# EAGLE design Main PDU (EAGLE 9.5.2)
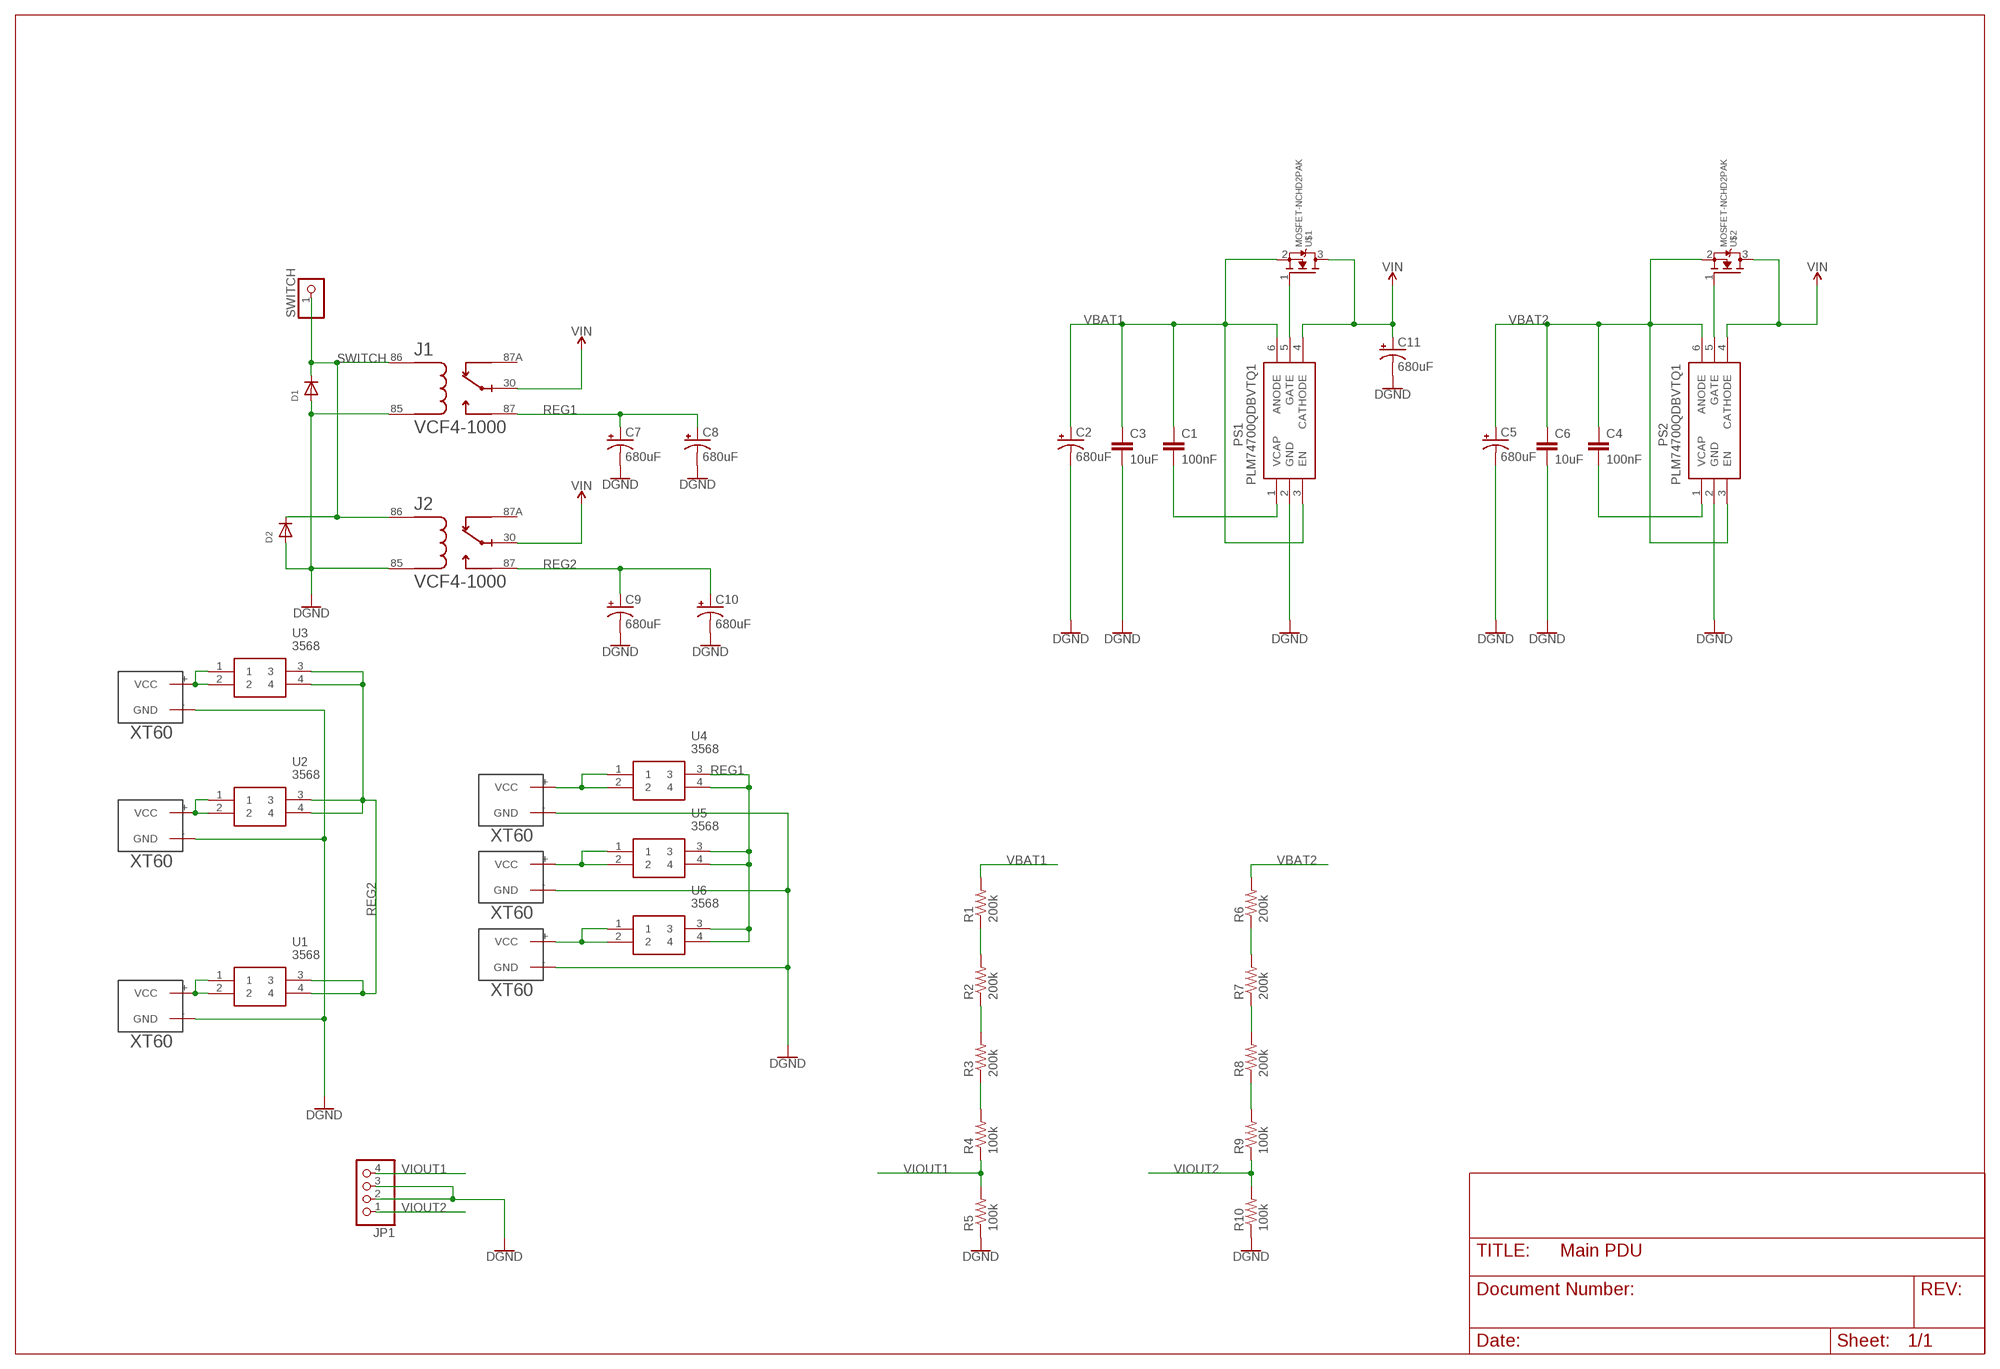
[diagram p0: schematic, sheet 1]

## Parts
C1  100nF  C-EUC0805  [C0805]
C2  680uF  CPOL-USE5-10.5  [E5-10,5]
C3  10uF  C-EUC1206  [C1206]
C4  100nF  C-EUC0805  [C0805]
C5  680uF  CPOL-USE5-10.5  [E5-10,5]
C6  10uF  C-EUC1206  [C1206]
C7  680uF  CPOL-USE5-10.5  [E5-10,5]
C8  680uF  CPOL-USE5-10.5  [E5-10,5]
C9  680uF  CPOL-USE5-10.5  [E5-10,5]
C10  680uF  CPOL-USE5-10.5  [E5-10,5]
C11  680uF  CPOL-USE5-10.5  [E5-10,5]
D1  DIODESOD-123  [SOD-123]
D2  DIODESOD-123  [SOD-123]
J1  VCF4-1000  [TE_VCF4-1000]
J2  VCF4-1000  [TE_VCF4-1000]
JP1  PINHD-1X4  [1X04]
PS1  PLM74700QDBVTQ1  [SOT95P280X145-6N]
PS2  PLM74700QDBVTQ1  [SOT95P280X145-6N]
R1  200k  R-US_R0805  [R0805]
R2  200k  R-US_R0805  [R0805]
R3  200k  R-US_R0805  [R0805]
R4  100k  R-US_R0805  [R0805]
R5  100k  R-US_R0805  [R0805]
R6  200k  R-US_R0805  [R0805]
R7  200k  R-US_R0805  [R0805]
R8  200k  R-US_R0805  [R0805]
R9  100k  R-US_R0805  [R0805]
R10  100k  R-US_R0805  [R0805]
SWITCH  PINHD-1X1  [1X01]
U1  3568  [3568]
U2  3568  [3568]
U3  3568  [3568]
U4  3568  [3568]
U5  3568  [3568]
U6  3568  [3568]
U$1  MOSFET-NCHD2PAK  [MBRB41H100CTT4G]
U$2  MOSFET-NCHD2PAK  [MBRB41H100CTT4G]
U$3  XT60  [XT60]
U$4  XT60  [XT60]
U$6  XT60  [XT60]
U$7  XT60  [XT60]
U$8  XT60  [XT60]
U$10  XT60  [XT60]

## Nets
GND: C2.- C3.2 C5.- C6.2 C7.- C8.- C9.- C10.- C11.- D1.A D2.A J1.85 J2.85 JP1.2 JP1.3 PS1.2(GND) PS2.2(GND) R5.1 R10.1 U$3.-(GND) U$4.-(GND) U$6.-(GND) U$7.-(GND) U$8.-(GND) U$10.-(GND) ; supply symbol labelled DGND
N$1: PS1.5(GATE) U$1.1(G)
N$2: C1.2 PS1.1(VCAP)
N$3: R1.1 R2.2
N$4: R2.1 R3.2
N$5: C4.2 PS2.1(VCAP)
N$6: PS2.5(GATE) U$2.1(G)
N$7: R3.1 R4.2
N$8: R6.1 R7.2
N$9: R7.1 R8.2
N$10: R8.1 R9.2
N$11: U1.1 U1.2 U$8.+(VCC)
N$12: U6.1 U6.2 U$4.+(VCC)
N$13: U3.1 U3.2 U$10.+(VCC)
N$15: U2.1 U2.2 U$7.+(VCC)
N$16: U5.1 U5.2 U$3.+(VCC)
N$18: U4.1 U4.2 U$6.+(VCC)
REG1: C7.+ C8.+ J1.87 U4.3 U4.4 U5.3 U5.4 U6.3 U6.4
REG2: C9.+ C10.+ J2.87 U1.3 U1.4 U2.3 U2.4 U3.3 U3.4
SWITCH: D1.C D2.C J1.86 J2.86 SWITCH.1
VBAT1: C1.1 C2.+ C3.1 PS1.3(EN) PS1.6(ANODE) R1.2 U$1.2(S)
VBAT2: C4.1 C5.+ C6.1 PS2.3(EN) PS2.6(ANODE) R6.2 U$2.2(S)
VIN: C11.+ J1.30 J2.30 PS1.4(CATHODE) PS2.4(CATHODE) U$1.3(D) U$2.3(D)
VIOUT1: JP1.4 R4.1 R5.2
VIOUT2: JP1.1 R9.1 R10.2
Unconnected: J1.87A J2.87A

## Library data of the parts
C1 C3 C4 C6 = rcl:C-EU: CAPACITOR, European symbol; SPICEPREFIX: C
C2 C5 C7-C11 = rcl:CPOL-US: POLARIZED CAPACITOR, American symbol; SPICEPREFIX: C
D1 D2 = adafruit:DIODE: Diode SMADIODE - SMA Surface Mount Package 20V 1A Schottky Diode Digikey: 641-1014-6-ND DO-1N4148 - Through Hole Small Current Diode SOD-123 20V 1 A (.5mV Vf) Schottky Diode - Digikey: MBRX120TPMSCT-ND SOD-323 10V 570mA (.38mV Vf, 3ns) Schottky Diode - Digikey: ZLLS410CT-ND SOD-523 30V 30mA Schottky Diode (RB751S-40TE61) - Digikey: RB751S-40TE61CT-ND SOT23-R/W - SOT23 Package (R = Solder Paste/Reflow Ovens, W = Hand-Soldering) BAT54Film 40V 300mA - Digikey: 497-7162-1-ND
J1 J2 = SPEAR:VCF4-1000: Socket, Relay; PCB, VTF Series, 1 Pole, Quick-Connect, w/o Grounding Provision; AVAILABILITY: Unavailable; COMMENT: 1393310-3; DESCRIPTION: Socket, Relay; PCB, VTF Series, 1 Pole, Quick-Connect, w/o Grounding Provision; MF: TE Connectivity; MP: VCF4-1000; PACKAGE: None; PRICE: None; PRODUCT_TYPE: Socket; TE_PURCHASE_URL: https://www.te.com/usa-en/product-1393310-3.html?te_bu=Cor&te_type=disp&te_campaign=seda_glo_cor-seda-global-disp-prtnr-fy19-seda-model-bom-cta_sma-317_1&elqCampaignId=32493
JP1 = pinhead:PINHD-1X4: PIN HEADER
PS1 PS2 = SPEAR:PLM74700QDBVTQ1: Low Iq, Always On Smart Diode Controller Source: Datasheet <http://www.ti.com/lit/gpn/lm74700-q1>; DESCRIPTION: Low Iq, Always On Smart Diode Controller; HEIGHT: 1.45mm; MANUFACTURER_NAME: Texas Instruments; MANUFACTURER_PART_NUMBER: PLM74700QDBVTQ1; MOUSER_PART_NUMBER: 595-PLM74700QDBVTQ1; MOUSER_PRICE-STOCK: https://www.mouser.com/Search/Refine.aspx?Keyword=595-PLM74700QDBVTQ1
R1-R10 = rcl:R-US_: RESISTOR, American symbol; SPICEPREFIX: R
SWITCH = pinhead:PINHD-1X1: PIN HEADER
U1-U6 = LCSC:3568: Fuse Holder .63 MINI FUSE HOLDER Source: Datasheet <http://www.keyelco.com/product-pdf.cfm?p=306>; ALLIED_NUMBER: 70182434; ALLIED_PRICE-STOCK: http://www.alliedelec.com/keystone-electronics-3568/70182434/; DESCRIPTION: Fuse Holder .63 MINI FUSE HOLDER; HEIGHT: 7.37mm; MANUFACTURER_NAME: Keystone Electronics; MANUFACTURER_PART_NUMBER: 3568; MOUSER_PART_NUMBER: 534-3568; MOUSER_PRICE-STOCK: https://www.mouser.com/Search/Refine.aspx?Keyword=534-3568
U$1 U$2 = SPEAR:MOSFET-NCH: N-Channel MOSFET like the IPB80N03S4L-03.
U$3 U$4 U$6-U$8 U$10 = LCSC:XT60: XT60

## Board
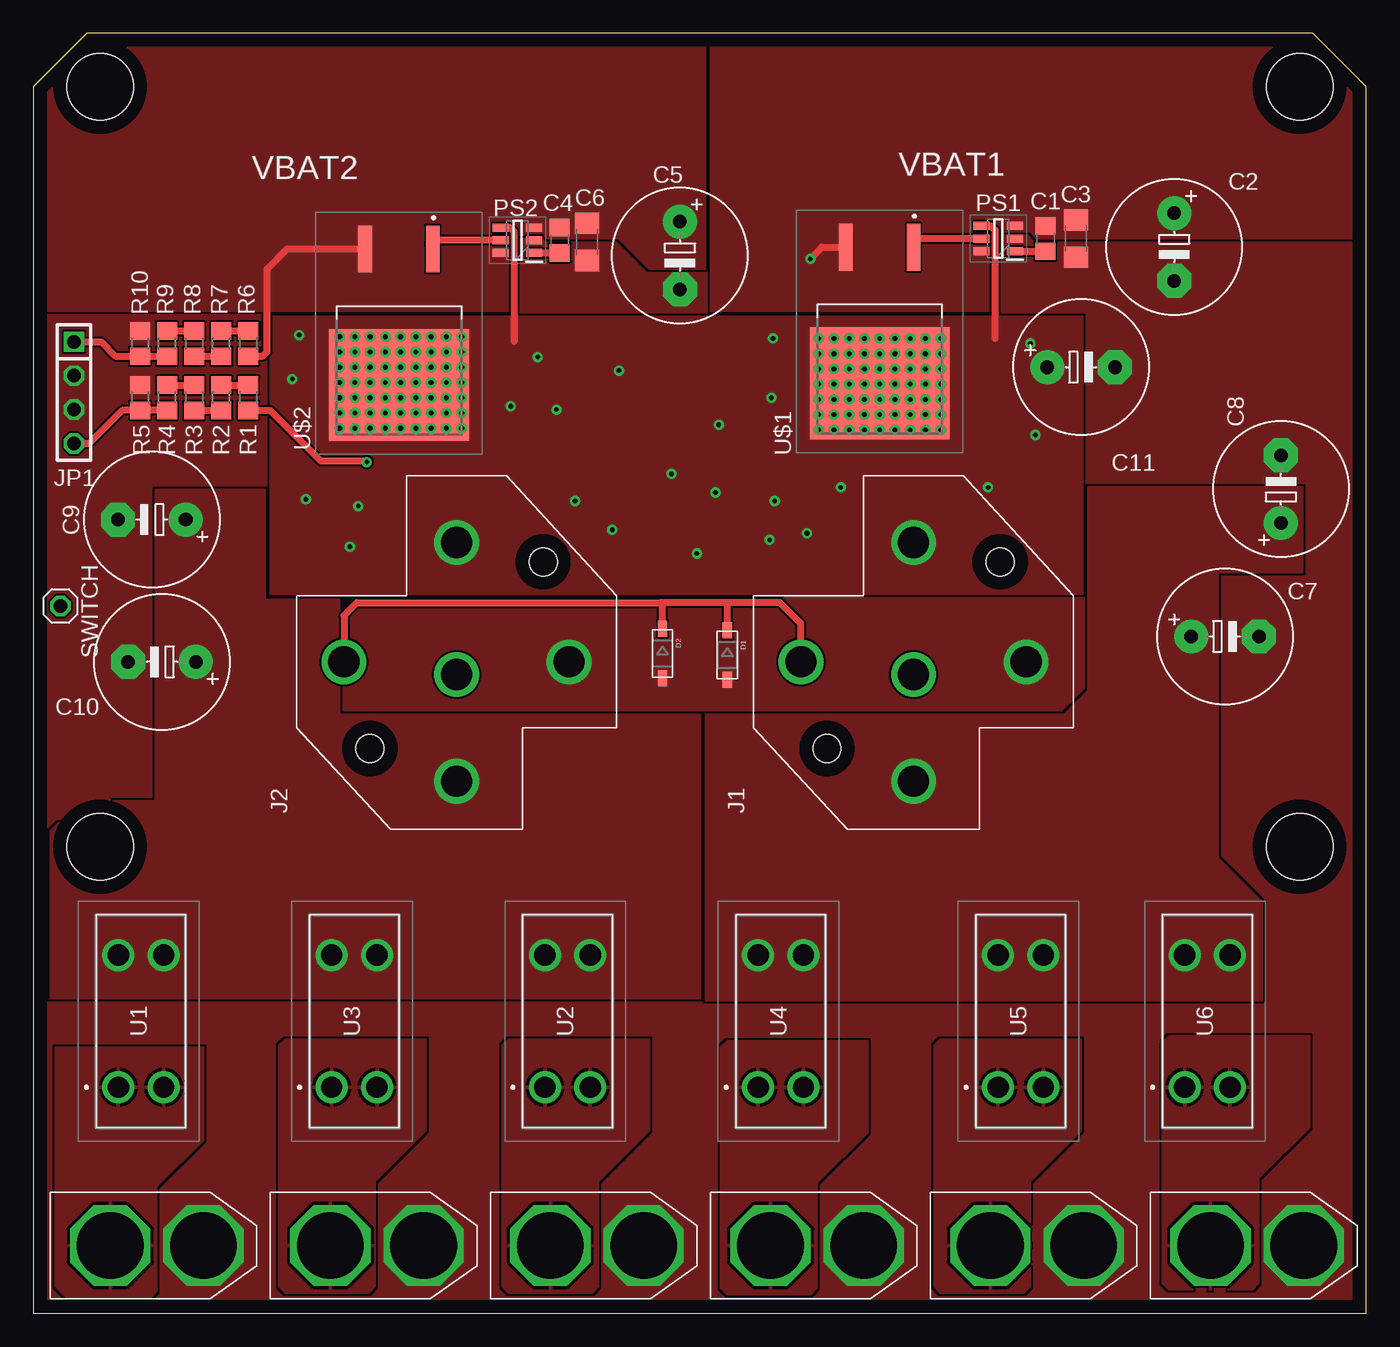
[diagram p1: board, top side]
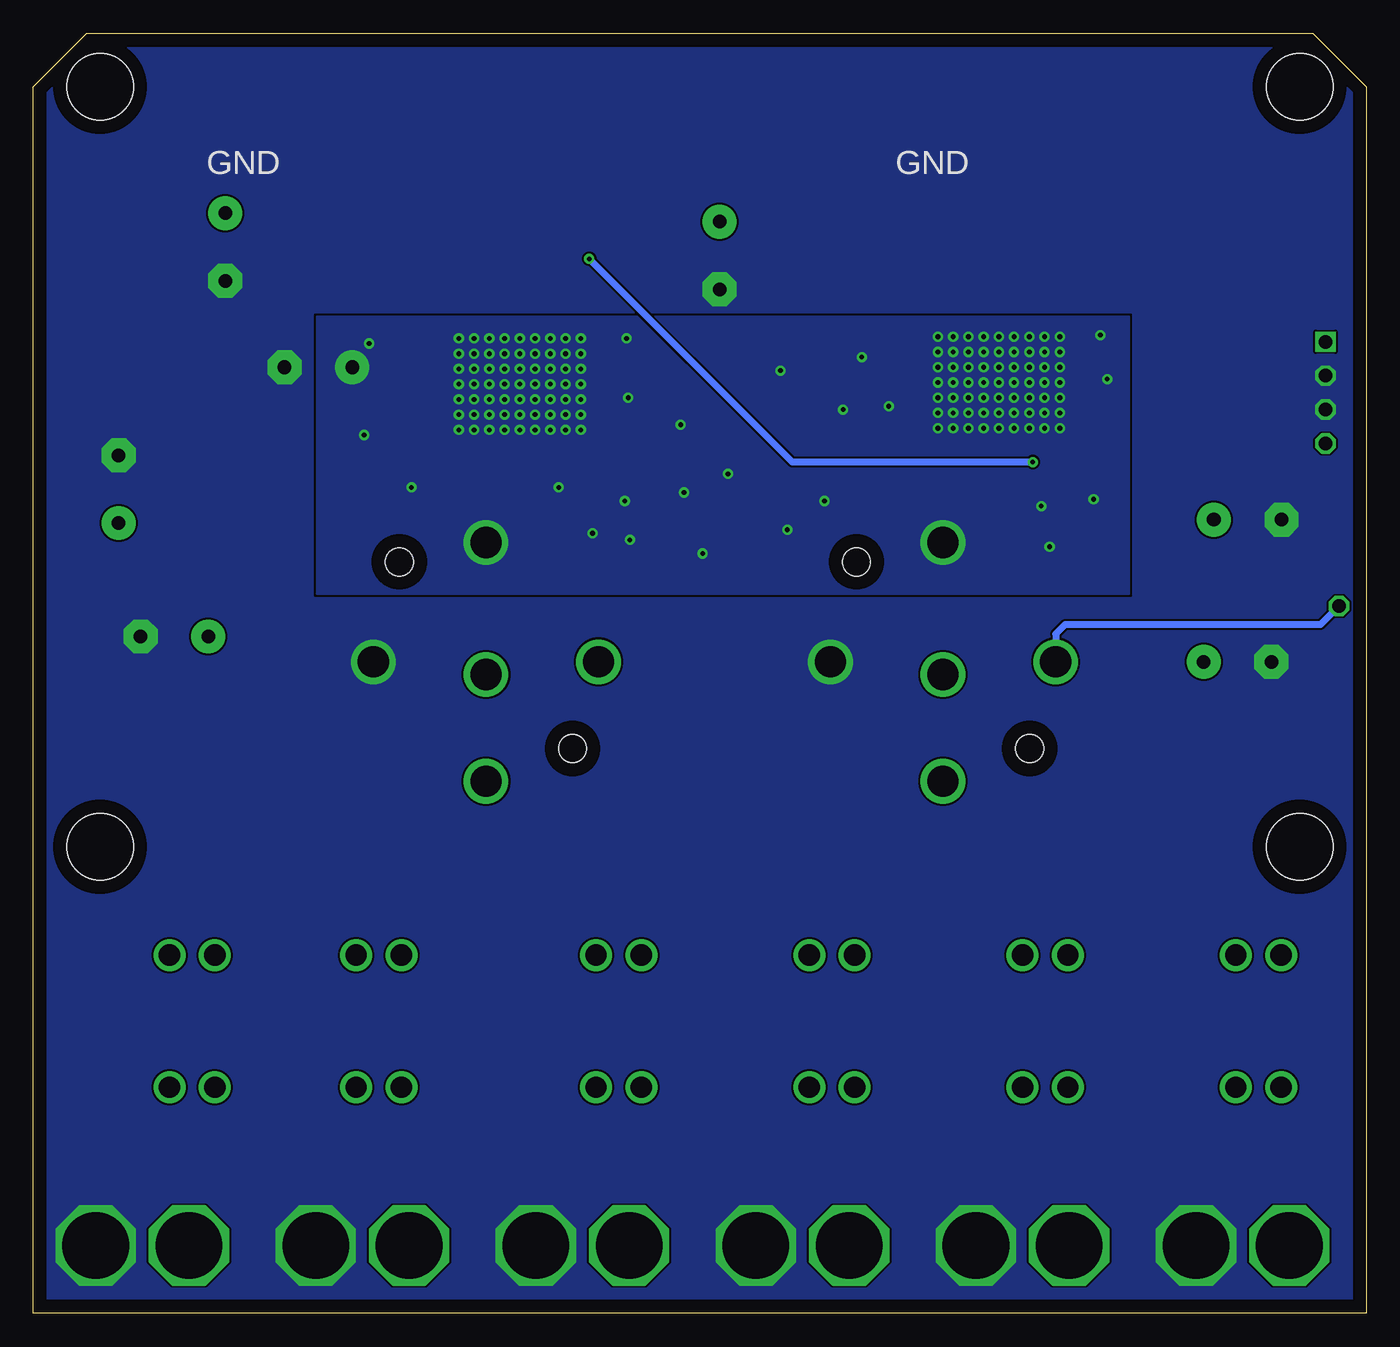
[diagram p2: board, bottom side, seen from below]

Size 100 x 96 mm. Coordinates in mm from the lower left corner, seen from the top.
Outline: 0,92 0,0 100,0 100,92 96,96 4,96 0,92
Copper layers (1*16): Top 0.035mm / dielectric 1.5mm / Bottom 0.035mm
Design rules "default *": minimum track width 6mil, minimum drill 0.35mm, track to track 6mil, track to pad 6mil, pad to pad 6mil, via to via 6mil, smd to smd 6mil, copper to edge 40mil, drill to drill 6mil, minimum pad ring 10mil, minimum via ring 8mil, stop-mask expansion 4mil, vias tented up to drill 20mil, thermal gap 10mil
Holes 5 mm at 5,92 95,92 95,35 5,35

### Footprints (pad centres in the part's own frame; a part is rotated, then mirrored left to right if it is on the bottom)
C0805 = smd 1.3 x 1.5: 1 -0.95,0; 2 0.95,0
E5-10,5 = drill 1.016 pad 2.54: + -2.54,0 | drill 1.016 pad 2.54 octagon: - 2.54,0
C1206 = smd 1.6 x 1.8: 1 -1.4,0; 2 1.4,0
SOD-123 = smd 1.2 x 0.7: A 1.85,0; C -1.85,0
TE_VCF4-1000 = drill 2.337: 30 8.95,0; 85 0,-8.45; 86 0,8.45; 87 -8.95,0; 87A -0.95,0 | hole 2.1: 7.5,-6.5; -6.5,6.5
1X04 = drill 1.016 square: 1 -3.81,0 | drill 1.016 octagon: 2 -1.27,0; 3 1.27,0; 4 3.81,0
SOT95P280X145-6N = smd 1.2 x 0.6: 1 -1.25,0.95; 2 -1.25,0; 3 -1.25,-0.95; 4 1.25,-0.95; 5 1.25,0; 6 1.25,0.95
R0805 = smd 1.3 x 1.5: 1 -0.95,0; 2 0.95,0
1X01 = drill 1.016 octagon: 1 0,0
3568 = drill 1.6 pad 2.4: 1 0,0; 2 0,-3.4; 3 9.92,0; 4 9.92,-3.4
MBRB41H100CTT4G = smd 1.016 x 3.504: 1 -2.54,-6.971; 2 2.54,-6.971 | smd 10.49 x 8.38: 3 0,3.242
XT60 = drill 5 octagon: + 4.5,0; - 11.5,0

### Placement (x,y rotation side)
C1  75.95,80.61 270 top
C2  85.6,79.97 270 top
C3  78.23,80.61 270 top
C4  39.5,80.48 270 top
C5  48.51,79.34 270 top
C6  41.53,80.36 270 top
C7  89.41,50.77 0 top
C8  93.6,61.81 90 top
C9  8.89,59.53 180 top
C10  9.65,48.86 180 top
C11  78.61,70.96 0 top
D1  52.07,49.37 270 top
D2  47.21,49.49 270 top
J1  66.04,48.86 90 top
J2  31.75,48.86 90 top
JP1  3.05,69.05 270 top
PS1  72.39,80.61 180 top
PS2  36.32,80.48 180 top
R1  16.13,68.67 270 top
R2  14.1,68.67 90 top
R3  12.06,68.67 270 top
R4  10.03,68.67 90 top
R5  8,68.67 270 top
R6  16.13,72.74 270 top
R7  14.1,72.74 90 top
R8  12.06,72.74 270 top
R9  10.03,72.74 90 top
R10  8,72.74 270 top
SWITCH  2.03,53.05 0 top
U1  6.38,16.95 90 top
U2  38.38,16.95 90 top
U3  22.38,16.95 90 top
U4  54.38,16.95 90 top
U5  72.38,16.95 90 top
U6  86.38,16.95 90 top
U$1  63.5,72.99 180 top
U$2  27.43,72.86 180 top
U$3  67.31,5.08 0 top
U$4  83.82,5.08 0 top
U$6  50.8,5.08 0 top
U$7  34.29,5.08 0 top
U$8  1.27,5.08 0 top
U$10  17.78,5.08 0 top

### Tracks (layer width: path | path; a pad name or v marks a point on that pad's centre or on a via)
GND
  pour Bottom (rank 6, no thermals): -1.27,97.12 -1.27,-1.27 101.6,-1.27 101.6,97.12
  pour Top (rank 6, no thermals): -1.27,97.12 -1.27,-1.27 101.6,-1.27 101.6,97.12
N$1
  Top 0.508: PS1.5 66.04,80.61 65.91,80.74 65.91,80.09 U$1.1
N$2
  Top 0.508: PS1.1 C1.2
N$3
  Top 0.508: R2.2 R1.1
N$4
  Top 0.508: R3.2 R2.1
N$5
  Top 0.508: PS2.1 C4.2
N$6
  Top 0.508: PS2.5 29.84,80.48 29.72,80.36 29.72,80.09 U$2.1
N$7
  Top 0.508: R4.2 R3.1
N$8
  Top 0.508: R7.2 R6.1
N$9
  Top 0.508: R8.2 R7.1
N$10
  Top 0.508: R9.2 R8.1
N$11
  pour Top: 1.65,19.94 12.76,19.94 12.76,13.02 9.27,9.53 9.27,1.65 8.76,1.14 2.54,1.14 1.65,2.03
N$12
  pour Top: 85.22,20.83 95.76,20.83 95.76,13.97 91.95,10.16 91.95,2.29 91.44,1.78 85.22,1.78 84.71,2.29 84.71,20.32
N$13
  pour Top: 18.92,20.57 29.46,20.57 29.46,13.72 25.65,9.91 25.65,2.03 25.15,1.52 18.92,1.52 18.41,2.03 18.41,20.07
N$15
  pour Top: 35.69,20.57 46.23,20.57 46.23,13.72 42.42,9.91 42.42,2.03 41.91,1.52 35.69,1.52 35.18,2.03 35.18,20.07
N$16
  pour Top: 68.07,20.57 78.61,20.57 78.61,13.72 74.8,9.91 74.8,2.03 74.3,1.52 68.07,1.52 67.56,2.03 67.56,20.07
N$18
  pour Top: 52.07,20.45 62.61,20.45 62.61,13.59 58.8,9.78 58.8,1.91 58.29,1.4 52.07,1.4 51.56,1.91 51.56,19.94
REG1
  pour Top (no thermals): 50.42,44.92 77.34,44.92 79.12,46.7 79.12,61.69 88.9,61.69 88.9,34.13 92.2,30.83 92.2,23.46 50.42,23.46
  pour Top (no thermals): 79.25,55.59 95.25,55.59 95.25,61.94 79.12,61.94 79.12,55.72
REG2
  pour Top (no thermals): 50.04,44.92 22.99,44.92 22.99,53.56 17.4,53.56 17.4,61.81 9.14,61.81 9.14,38.45 3.56,38.45 1.27,36.16 1.27,23.59 50.04,23.59
SWITCH
  Top 0.508: J1.86 57.59,51.72 56.01,53.3 52.2,53.3 | 52.2,53.3 47.09,53.3 | D1.C 52.07,53.18 52.2,53.3 | D2.C 47.21,53.18 47.09,53.3 | J2.86 23.3,52.35 24.26,53.3 47.09,53.3
  Bottom 0.508: SWITCH.1 3.43,51.65 22.61,51.65 23.3,50.96 J2.86
VBAT1  (via drill 0.35)
  Top 0.508: R1.2 17.78,67.72 21.59,63.91 24.95,63.91 v25.02,63.85 | v58.29,79.09 59.17,79.96 U$1.2
  Bottom 0.508: v25.02,63.85 43.05,63.85 v58.29,79.09
  pour Top (no thermals): 50.8,75.15 71.88,75.15 71.88,81.12 74.8,81.12 75.31,80.61 99.82,80.61 99.82,95.85 50.8,95.85
VBAT2
  Top 0.508: R6.2 17.21,71.79 17.53,72.1 17.53,78.32 19.04,79.83 U$2.2
  pour Top (no thermals): 0.13,75.15 35.81,75.15 35.81,80.86 38.35,80.86 38.61,80.61 43.94,80.61 46.23,78.32 50.42,78.32 50.42,95.85 0.13,95.85
VIN  (via drill 0.35)
  Top 0.508: PS2.4 35.75,81.43 36.08,81.11 36.08,72.87 | PS1.4 71.82,81.56 72.15,81.23 72.15,73.13
  other vias: 22.99,73.24 24.13,73.24 25.27,73.24 26.42,73.24 27.56,73.24 28.7,73.24 29.84,73.24 30.99,73.24 32.13,73.24 22.99,72.1 24.13,72.1 25.27,72.1 26.42,72.1 27.56,72.1 28.7,72.1 29.84,72.1 30.99,72.1 32.13,72.1 32.13,70.96 30.99,70.96 29.84,70.96 28.7,70.96 27.56,70.96 26.42,70.96 25.27,70.96 24.13,70.96 22.99,70.96 22.99,69.81 24.13,69.81 25.27,69.81 26.42,69.81 27.56,69.81 28.7,69.81 29.84,69.81 30.99,69.81 32.13,69.81 32.13,68.67 30.99,68.67 29.84,68.67 28.7,68.67 27.56,68.67 26.42,68.67 25.27,68.67 24.13,68.67 22.99,68.67 22.99,67.53 24.13,67.53 25.27,67.53 26.42,67.53 27.56,67.53 28.7,67.53 29.84,67.53 30.99,67.53 32.13,67.53 32.13,66.39 30.99,66.39 29.84,66.39 28.7,66.39 27.56,66.39 26.42,66.39 25.27,66.39 24.13,66.39 22.99,66.39 58.93,73.12 58.93,71.97 60.07,73.12 61.21,73.12 62.36,73.12 63.5,73.12 64.64,73.12 65.79,73.12 66.93,73.12 68.07,73.12 68.07,71.97 66.93,71.97 65.79,71.97 64.64,71.97 63.5,71.97 62.36,71.97 61.21,71.97 60.07,71.97 58.93,70.83 60.07,70.83 61.21,70.83 62.36,70.83 63.5,70.83 64.64,70.83 65.79,70.83 66.93,70.83 68.07,70.83 68.07,69.69 66.93,69.69 65.79,69.69 64.64,69.69 63.5,69.69 62.36,69.69 61.21,69.69 60.07,69.69 58.93,69.69 58.93,68.55 60.07,68.55 61.21,68.55 62.36,68.55 63.5,68.55 64.64,68.55 65.79,68.55 66.93,68.55 68.07,68.55 68.07,67.4 66.93,67.4 65.79,67.4 64.64,67.4 63.5,67.4 62.36,67.4 61.21,67.4 60.07,67.4 58.93,67.4 58.93,66.26 60.07,66.26 61.21,66.26 62.36,66.26 63.5,66.26 64.64,66.26 65.79,66.26 66.93,66.26 68.07,66.26 39.24,67.78 43.94,70.7 37.85,71.72 35.81,68.04 47.88,62.96 51.44,66.64 55.63,60.92 49.78,56.99 43.43,58.77 51.18,61.56 58.04,58.51 55.37,68.67 55.5,73.12 60.58,61.94 40.64,60.92 24.38,60.54 23.75,57.5 20.45,61.05 19.43,70.07 19.94,73.37 55.24,58 74.8,72.74 75.18,65.88 71.63,61.94
  pour Top (no thermals): 17.78,74.77 17.78,53.94 78.74,53.94 78.74,74.77
  pour Bottom (no thermals): 17.78,74.77 17.78,53.94 78.74,53.94 78.74,74.77
VIOUT1
  Top 0.508: R4.1 R5.2 6.67,67.72 4.19,65.24 JP1.4
VIOUT2
  Top 0.508: JP1.1 5.08,72.86 6.16,71.79 R10.2 R9.1

### Text on the board
bPlace: GND | GND
tNames: VBAT2 | VBAT1